# Altium schematic sheet Client_Node_2.SchDoc: Client_Node_2
size A4; DrawnBy: Project_Vega_Team; Revision: 1; SheetNumber: 8; SheetTotal: 8
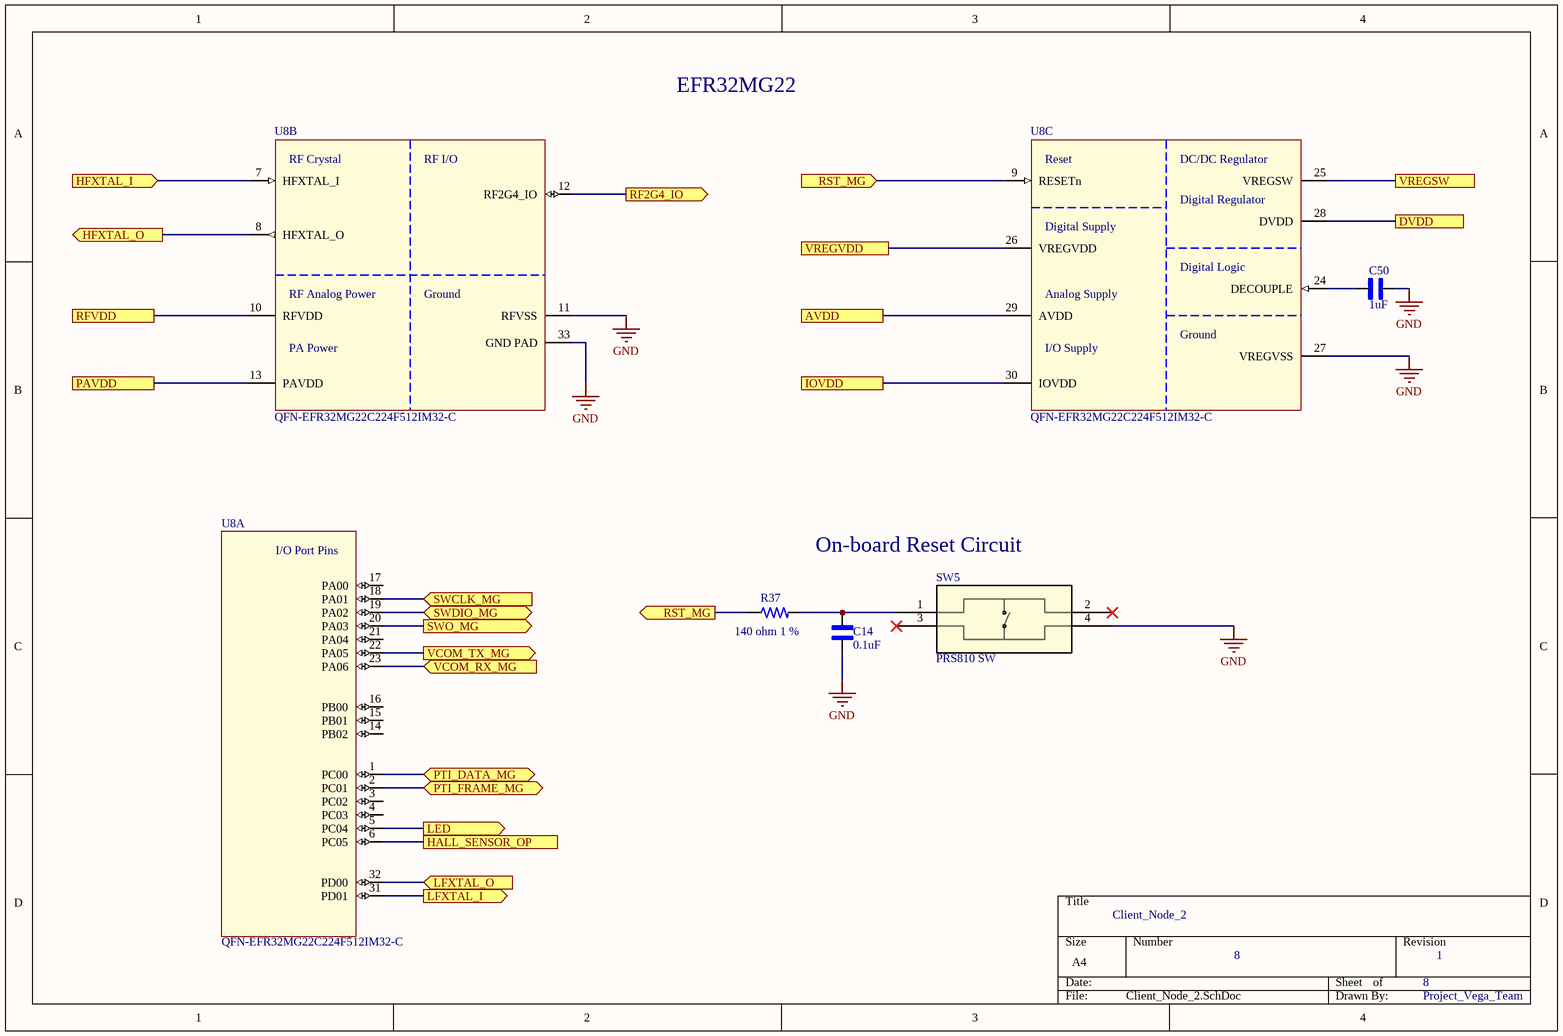
[diagram p0: Client_Node_2.SchDoc]

## Parts
C14  0.1uF  [CAPC1608X90]
C50  1uF  [CAPC1608X90]
R37  140 ohm 1 %  [RES_0603_1608X06]
SW5  PRS810 SW  [PTS810_CNK]
U8  QFN-EFR32MG22C224F512IM32-C  [QFN32-EFR32xG2xIM32-BR]  (parts A,B,C of 3)

## Ports
AVDD (see Client_Node_1[3D]), DVDD (see Client_Node_1[2B]), HALL_SENSOR_OP (see Client_Node_1[1B], Client_Node_1[4A]), HFXTAL_I (in, see Client_Node_1[4C]), HFXTAL_O (out, see Client_Node_1[3C]), IOVDD (see Client_Node_1[3D]), LED (out, see Client_Node_1[4C]), LFXTAL_I (out, see Client_Node_1[3C]), LFXTAL_O (in, see Client_Node_1[4C]), PAVDD (see Client_Node_1[3B]), PTI_DATA_MG (bidir, see Client_Node_1[2A]), PTI_FRAME_MG (bidir, see Client_Node_1[2A]), RF2G4_IO (out, see Client_Node_1[1C]), RFVDD (see Client_Node_1[3A]), RST_MG (in, see Client_Node_1[2A], Client_Node_2[2C]), RST_MG (out, see Client_Node_1[2A], Client_Node_2[3A]), SWCLK_MG (in, see Client_Node_1[2A]), SWDIO_MG (bidir, see Client_Node_1[2A]), SWO_MG (out, see Client_Node_1[2A]), VCOM_RX_MG (in, see Client_Node_1[2A]), VCOM_TX_MG (out, see Client_Node_1[2A]), VREGSW (see Client_Node_1[2C]), VREGVDD (see Client_Node_1[3C])

## Nets
GND: C14.2 C50.2 SW5.4 U8.11(RFVSS) U8.27(VREGVSS) U8.33(GND_PAD)
AVDD: U8.29(AVDD) ; port AVDD
DVDD: U8.28(DVDD) ; port DVDD
HALL_SENSOR_OP: U8.6(PC05) ; port HALL_SENSOR_OP
HFXTAL_I: U8.7(HFXTAL_I) ; port HFXTAL_I
HFXTAL_O: U8.8(HFXTAL_O) ; port HFXTAL_O
IOVDD: U8.30(IOVDD) ; port IOVDD
LED: U8.5(PC04) ; port LED
LFXTAL_I: U8.31(PD01) ; port LFXTAL_I
LFXTAL_O: U8.32(PD00) ; port LFXTAL_O
PAVDD: U8.13(PAVDD) ; port PAVDD
PTI_DATA_MG: U8.1(PC00) ; port PTI_DATA_MG
PTI_FRAME_MG: U8.2(PC01) ; port PTI_FRAME_MG
RF2G4_IO: U8.12(RF2G4_IO) ; port RF2G4_IO
RFVDD: U8.10(RFVDD) ; port RFVDD
RST_MG: R37.1 U8.9(RESETn) ; port RST_MG
SWCLK_MG: U8.18(PA01) ; port SWCLK_MG
SWDIO_MG: U8.19(PA02) ; port SWDIO_MG
SWO_MG: U8.20(PA03) ; port SWO_MG
VCOM_RX_MG: U8.23(PA06) ; port VCOM_RX_MG
VCOM_TX_MG: U8.22(PA05) ; port VCOM_TX_MG
VREGSW: U8.25(VREGSW) ; port VREGSW
VREGVDD: U8.26(VREGVDD) ; port VREGVDD
NetC14_1: C14.1 R37.2 SW5.1
NetC50_1: C50.1 U8.24(DECOUPLE)

Not connected (* = marked no-connect by the designer): SW5 2* 3*; U8 3(PC02) 4(PC03) 14(PB02) 15(PB01) 16(PB00) 17(PA00) 21(PA04)

## Notes on the sheet
- EFR32MG22
- On-board Reset Circuit
- (in symbol EFR32MG22C224F512IM32-C, part A) I/O Port Pins
- (in symbol EFR32MG22C224F512IM32-C, part B) RF Crystal; RF I/O; RF Analog Power; Ground; PA Power
- (in symbol EFR32MG22C224F512IM32-C, part C) Reset; DC/DC Regulator; Digital Regulator; Digital Supply; Digital Logic; Analog Supply; Ground; I/O Supply

## Library data of the parts
C14 C50 = CC0603KRX7R9BB104: 0.1 ÂµF Â±10% 50V Ceramic Capacitor X7R 0603 (1608 Metric); MF: Yageo; SnapEDA_Link: https://www.snapeda.com/parts/CC0603KRX7R9BB104/Yageo/view-part/?ref=snap; Package: 0603 Yageo; Value: *; MP: CC0603KRX7R9BB104; Check_prices: https://www.snapeda.com/parts/CC0603KRX7R9BB104/Yageo/view-part/?ref=eda
  C50: Supplier 1: Digikey; Supplier Part Number 1: 445-12472-1-ND
R37 = RC0603FR-07140RL: SMD Chip Resistor, 140 Ohm, ± 1%, 100 mW, 0603 [1608 Metric], Thick Film, General Purpose; Manufacturer: Yageo; Value: 140R; Power Rating: 100mW; Voltage Rating: 50V; Temperature Coefficient: 100ppm/°C; Supplier: Digikey; Supplier Part Number: 311-140HRCT-ND; Manufacturer Part Number: RC0603FR-07140RL; RoHS: Yes; Category: Chip SMD Resistors; Stock: 238807; Pricing: 1=0.1, 10=0.019, 50=0.0112, 100=0.0093, 500=0.00622, 1000=0.00532, 5000=0.00382, 10000=0.00335, 25000=0.00287, 35000=0.00278, 50000=0.00257, 125000=0.00232 (USD); Mounting Technology: Surface Mount; Case/Package: 0603; Case Code (Imperial): 0603; Case Code (Metric): 1608; Min Operating Temperature: -55°C; Max Operating Temperature: 155°C; Tolerance: 1%; Packaging: Tape and Reel; Termination: SMD/SMT; Voltage Rating (DC): 50V; Features: Moisture Resistant; Series: RC; Max Power Dissipation: 100mW; Number of Terminations: 2; Construction: Rectangular; Technology: THICK FILM; Length: 1.6mm; Height: 0.45mm; Depth: 0.8mm; Lead Free: Lead Free; RoHS Compliant: Yes; Military Standard: Not; ComponentLink1URL: https://datasheet.ciiva.com/11808/0900766b80c66297-11808828.pdf?src-supplier=Rs; ComponentLink1Description: https://datasheet.ciiva.com/11808/0900766b80c66297-11808828.pdf?src-supplier=Rs; ComponentLink2URL: https://datasheet.ciiva.com/15189/getdatasheetpartid-329205-15189606.pdf?src-supplier=Verical; ComponentLink2Description: https://datasheet.ciiva.com/15189/getdatasheetpartid-329205-15189606.pdf?src-supplier=Verical
SW5 = PTS810SJM250SMTRLFS: Switch Tactile N.O. SPST Button J-Bend 0.05A 16V 150000Cycles 1.569N SMD T/R; Manufacturer: ITT C&K; Actuator Color: Grey; Operating Force: 160gf; Current Rating: 50mA; Illumination Type: Non-Illuminated; Switch Travel: 0.15mm; Switch Function: Off-Mom; Number of Positions: 2; Actuator Type: Standard; Contact Resistance: 500mR; Supplier: Digikey; Supplier Part Number: CKN10502CT-ND; Manufacturer Part Number: PTS810SJM250SMTRLFS; RoHS: Yes; Stock: 130228; Pricing: 1=0.49, 10=0.474, 25=0.4568, 100=0.3954, 250=0.36028, 500=0.3339, 1000=0.29876, 2900=0.28294, 5800=0.26185, 14500=0.24428 (USD); Mounting Technology: Surface Mount; Case/Package: SMD/SMT; Pins: 4; Mechanical Life: 150000Cycles; Color: Black; Contact Plating: Silver; Min Operating Temperature: -40°C; Max Operating Temperature: 85°C; Throw Configuration: SPST; Packaging: Tape and Reel; Voltage Rating (DC): 16V; Package Quantity: 2900; Series: PTS810; Termination: J-Bend; Max Current Rating: 50mA; Orientation: Straight; Contact Current Rating: 50mA; Length: 3.2mm; Depth: 4.6mm; RoHS Compliant: Yes; Lead Free: Lead Free; ComponentLink1URL: https://datasheet.ciiva.com/24082/pts810-4mar13-248115-24082262.pdf?src-supplier=Mouser; ComponentLink1Description: https://datasheet.ciiva.com/24082/pts810-4mar13-248115-24082262.pdf?src-supplier=Mouser; ComponentLink2URL: https://datasheet.ciiva.com/18514/pts810-4mar13-18514058.pdf?src-supplier=Digikey; ComponentLink2Description: https://datasheet.ciiva.com/18514/pts810-4mar13-18514058.pdf?src-supplier=Digikey; ComponentLink3URL: https://datasheet.ciiva.com/18514/pts810-4mar13-18514059.pdf?src-supplier=Digikey; ComponentLink3Description: https://datasheet.ciiva.com/18514/pts810-4mar13-18514059.pdf?src-supplier=Digikey; ComponentLink4URL: https://datasheet.ciiva.com/18514/pts810-4mar13-18514060.pdf?src-supplier=Digikey; ComponentLink4Description: https://datasheet.ciiva.com/18514/pts810-4mar13-18514060.pdf?src-supplier=Digikey
U8 = EFR32MG22C224F512IM32-C: Mighty Gecko, QFN32, 2.4G, 6dB, Mesh, 512kB, 32kB(RAM), 18 GPIO; Manufacturer: Silicon Labs; Supplier: Digikey; Supplier Part Number: 336-EFR32MG22C224F512IM32-C-ND; Manufacturer Part Number: EFR32MG22C224F512IM32-C; RoHS: No; Category: RF Receivers, Transceivers; Stock: 1733; Pricing: 1=3, 10=2.68, 25=2.4124, 80=2.19775, 230=1.98339, 490=1.88751 (USD); Series: -; RoHS Compliant: Yes; ComponentLink1URL: https://media.digikey.com/pdf/Data%20Sheets/Silicon%20Laboratories%20PDFs/EFR32MG22C224F512_DS.pdf?src-supplier=Digikey; ComponentLink1Description: https://media.digikey.com/pdf/Data%20Sheets/Silicon%20Laboratories%20PDFs/EFR32MG22C224F512_DS.pdf?src-supplier=Digikey